# Altium project 6th design.PrjPcb
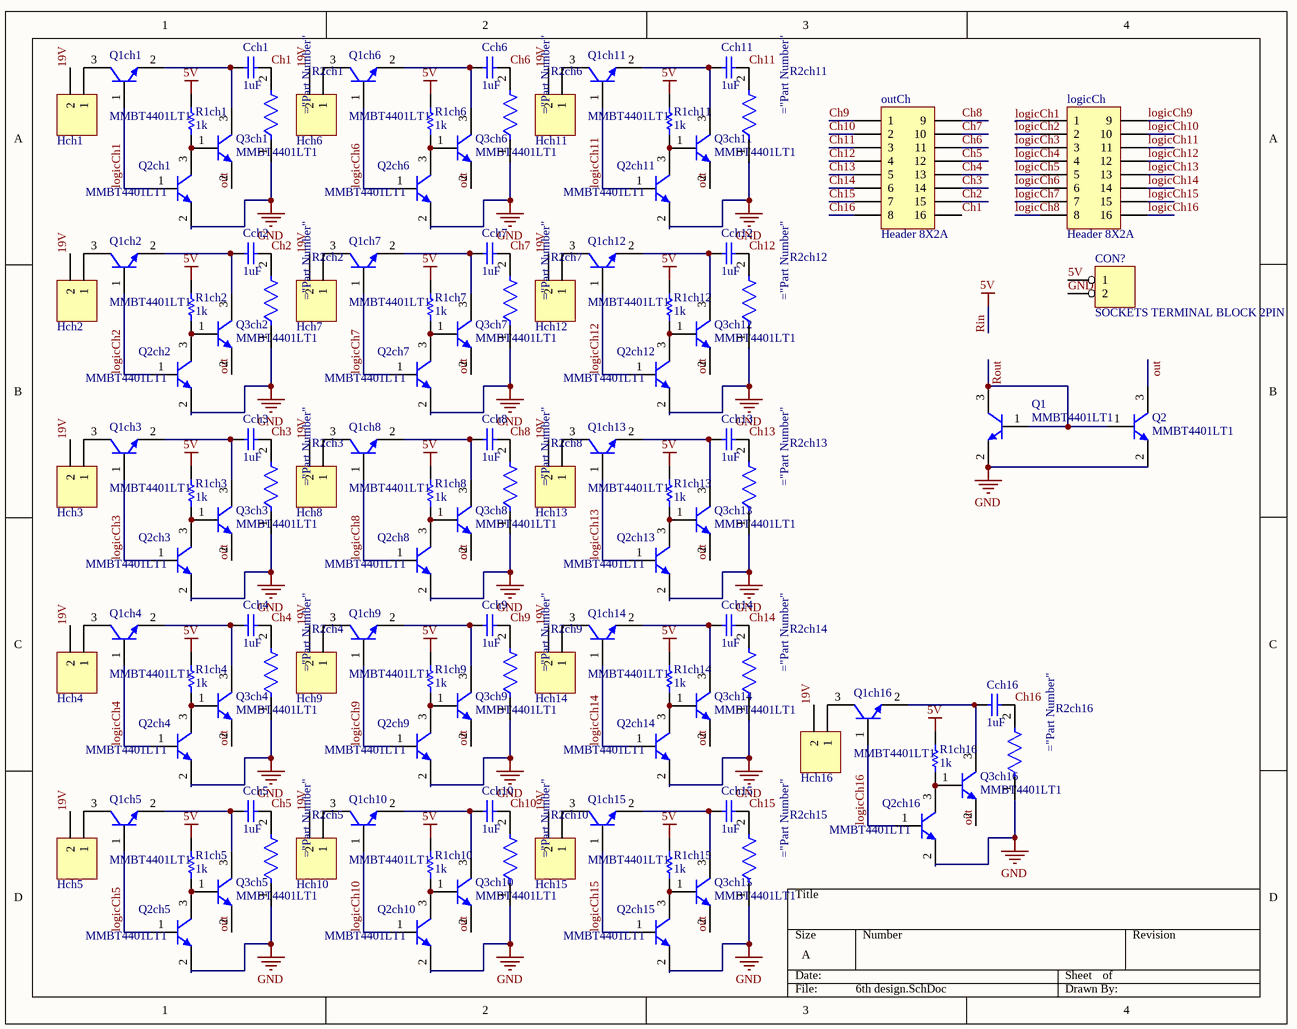
[diagram p0: 6th design.SchDoc]
3 sheets, 142 parts. Net scope: global (net labels, ports and power ports of the same name join across sheets).
Board file: 6th design.PcbDoc
Sheets:
  6th design.SchDoc
  digipot.SchDoc
  step-up.SchDoc

## Sheet 6th design.SchDoc
size A

### Parts
Cch1  value 1uF  [CC2012-0805]  (hidden comment: Cap-NP)
Cch2  value 1uF  [CC2012-0805]  (hidden comment: Cap-NP)
Cch3  value 1uF  [CC2012-0805]  (hidden comment: Cap-NP)
Cch4  value 1uF  [CC2012-0805]  (hidden comment: Cap-NP)
Cch5  value 1uF  [CC2012-0805]  (hidden comment: Cap-NP)
Cch6  value 1uF  [CC2012-0805]  (hidden comment: Cap-NP)
Cch7  value 1uF  [CC2012-0805]  (hidden comment: Cap-NP)
Cch8  value 1uF  [CC2012-0805]  (hidden comment: Cap-NP)
Cch9  value 1uF  [CC2012-0805]  (hidden comment: Cap-NP)
Cch10  value 1uF  [CC2012-0805]  (hidden comment: Cap-NP)
Cch11  value 1uF  [CC2012-0805]  (hidden comment: Cap-NP)
Cch12  value 1uF  [CC2012-0805]  (hidden comment: Cap-NP)
Cch13  value 1uF  [CC2012-0805]  (hidden comment: Cap-NP)
Cch14  value 1uF  [CC2012-0805]  (hidden comment: Cap-NP)
Cch15  value 1uF  [CC2012-0805]  (hidden comment: Cap-NP)
Cch16  value 1uF  [CC2012-0805]  (hidden comment: Cap-NP)
CON?  SOCKETS TERMINAL BLOCK 2PIN  [Sockets Terminal Block 2Pin]
Hch1  H2  [HDR1X2]  (value not drawn)
Hch2  H2  [HDR1X2]  (value not drawn)
Hch3  H2  [HDR1X2]  (value not drawn)
Hch4  H2  [HDR1X2]  (value not drawn)
Hch5  H2  [HDR1X2]  (value not drawn)
Hch6  H2  [HDR1X2]  (value not drawn)
Hch7  H2  [HDR1X2]  (value not drawn)
Hch8  H2  [HDR1X2]  (value not drawn)
Hch9  H2  [HDR1X2]  (value not drawn)
Hch10  H2  [HDR1X2]  (value not drawn)
Hch11  H2  [HDR1X2]  (value not drawn)
Hch12  H2  [HDR1X2]  (value not drawn)
Hch13  H2  [HDR1X2]  (value not drawn)
Hch14  H2  [HDR1X2]  (value not drawn)
Hch15  H2  [HDR1X2]  (value not drawn)
Hch16  H2  [HDR1X2]  (value not drawn)
logicCh  Header 8X2A  [HDR2X8_CEN]
outCh  Header 8X2A  [HDR2X8_CEN]
Q1  MMBT4401LT1  [ONSC-SOT-23-3-318-08_V]
Q1ch1  MMBT4401LT1  [ONSC-SOT-23-3-318-08_V]
Q1ch2  MMBT4401LT1  [ONSC-SOT-23-3-318-08_V]
Q1ch3  MMBT4401LT1  [ONSC-SOT-23-3-318-08_V]
Q1ch4  MMBT4401LT1  [ONSC-SOT-23-3-318-08_V]
Q1ch5  MMBT4401LT1  [ONSC-SOT-23-3-318-08_V]
Q1ch6  MMBT4401LT1  [ONSC-SOT-23-3-318-08_V]
Q1ch7  MMBT4401LT1  [ONSC-SOT-23-3-318-08_V]
Q1ch8  MMBT4401LT1  [ONSC-SOT-23-3-318-08_V]
Q1ch9  MMBT4401LT1  [ONSC-SOT-23-3-318-08_V]
Q1ch10  MMBT4401LT1  [ONSC-SOT-23-3-318-08_V]
Q1ch11  MMBT4401LT1  [ONSC-SOT-23-3-318-08_V]
Q1ch12  MMBT4401LT1  [ONSC-SOT-23-3-318-08_V]
Q1ch13  MMBT4401LT1  [ONSC-SOT-23-3-318-08_V]
Q1ch14  MMBT4401LT1  [ONSC-SOT-23-3-318-08_V]
Q1ch15  MMBT4401LT1  [ONSC-SOT-23-3-318-08_V]
Q1ch16  MMBT4401LT1  [ONSC-SOT-23-3-318-08_V]
Q2  MMBT4401LT1  [ONSC-SOT-23-3-318-08_V]
Q2ch1  MMBT4401LT1  [ONSC-SOT-23-3-318-08_V]
Q2ch2  MMBT4401LT1  [ONSC-SOT-23-3-318-08_V]
Q2ch3  MMBT4401LT1  [ONSC-SOT-23-3-318-08_V]
Q2ch4  MMBT4401LT1  [ONSC-SOT-23-3-318-08_V]
Q2ch5  MMBT4401LT1  [ONSC-SOT-23-3-318-08_V]
Q2ch6  MMBT4401LT1  [ONSC-SOT-23-3-318-08_V]
Q2ch7  MMBT4401LT1  [ONSC-SOT-23-3-318-08_V]
Q2ch8  MMBT4401LT1  [ONSC-SOT-23-3-318-08_V]
Q2ch9  MMBT4401LT1  [ONSC-SOT-23-3-318-08_V]
Q2ch10  MMBT4401LT1  [ONSC-SOT-23-3-318-08_V]
Q2ch11  MMBT4401LT1  [ONSC-SOT-23-3-318-08_V]
Q2ch12  MMBT4401LT1  [ONSC-SOT-23-3-318-08_V]
Q2ch13  MMBT4401LT1  [ONSC-SOT-23-3-318-08_V]
Q2ch14  MMBT4401LT1  [ONSC-SOT-23-3-318-08_V]
Q2ch15  MMBT4401LT1  [ONSC-SOT-23-3-318-08_V]
Q2ch16  MMBT4401LT1  [ONSC-SOT-23-3-318-08_V]
Q3ch1  MMBT4401LT1  [ONSC-SOT-23-3-318-08_V]
Q3ch2  MMBT4401LT1  [ONSC-SOT-23-3-318-08_V]
Q3ch3  MMBT4401LT1  [ONSC-SOT-23-3-318-08_V]
Q3ch4  MMBT4401LT1  [ONSC-SOT-23-3-318-08_V]
Q3ch5  MMBT4401LT1  [ONSC-SOT-23-3-318-08_V]
Q3ch6  MMBT4401LT1  [ONSC-SOT-23-3-318-08_V]
Q3ch7  MMBT4401LT1  [ONSC-SOT-23-3-318-08_V]
Q3ch8  MMBT4401LT1  [ONSC-SOT-23-3-318-08_V]
Q3ch9  MMBT4401LT1  [ONSC-SOT-23-3-318-08_V]
Q3ch10  MMBT4401LT1  [ONSC-SOT-23-3-318-08_V]
Q3ch11  MMBT4401LT1  [ONSC-SOT-23-3-318-08_V]
Q3ch12  MMBT4401LT1  [ONSC-SOT-23-3-318-08_V]
Q3ch13  MMBT4401LT1  [ONSC-SOT-23-3-318-08_V]
Q3ch14  MMBT4401LT1  [ONSC-SOT-23-3-318-08_V]
Q3ch15  MMBT4401LT1  [ONSC-SOT-23-3-318-08_V]
Q3ch16  MMBT4401LT1  [ONSC-SOT-23-3-318-08_V]
R1ch1  value 1k  [CC2012-0805]  (hidden comment: Res)
R1ch2  value 1k  [CC2012-0805]  (hidden comment: Res)
R1ch3  value 1k  [CC2012-0805]  (hidden comment: Res)
R1ch4  value 1k  [CC2012-0805]  (hidden comment: Res)
R1ch5  value 1k  [CC2012-0805]  (hidden comment: Res)
R1ch6  value 1k  [CC2012-0805]  (hidden comment: Res)
R1ch7  value 1k  [CC2012-0805]  (hidden comment: Res)
R1ch8  value 1k  [CC2012-0805]  (hidden comment: Res)
R1ch9  value 1k  [CC2012-0805]  (hidden comment: Res)
R1ch10  value 1k  [CC2012-0805]  (hidden comment: Res)
R1ch11  value 1k  [CC2012-0805]  (hidden comment: Res)
R1ch12  value 1k  [CC2012-0805]  (hidden comment: Res)
R1ch13  value 1k  [CC2012-0805]  (hidden comment: Res)
R1ch14  value 1k  [CC2012-0805]  (hidden comment: Res)
R1ch15  value 1k  [CC2012-0805]  (hidden comment: Res)
R1ch16  value 1k  [CC2012-0805]  (hidden comment: Res)
R2ch1  ERJ-A1BJ1R2U  [Panasonic_ERJ-A1BJ1R2U_0]  (value not drawn)
R2ch2  ERJ-A1BJ1R2U  [Panasonic_ERJ-A1BJ1R2U_0]  (value not drawn)
R2ch3  ERJ-A1BJ1R2U  [Panasonic_ERJ-A1BJ1R2U_0]  (value not drawn)
R2ch4  ERJ-A1BJ1R2U  [Panasonic_ERJ-A1BJ1R2U_0]  (value not drawn)
R2ch5  ERJ-A1BJ1R2U  [Panasonic_ERJ-A1BJ1R2U_0]  (value not drawn)
R2ch6  ERJ-A1BJ1R2U  [Panasonic_ERJ-A1BJ1R2U_0]  (value not drawn)
R2ch7  ERJ-A1BJ1R2U  [Panasonic_ERJ-A1BJ1R2U_0]  (value not drawn)
R2ch8  ERJ-A1BJ1R2U  [Panasonic_ERJ-A1BJ1R2U_0]  (value not drawn)
R2ch9  ERJ-A1BJ1R2U  [Panasonic_ERJ-A1BJ1R2U_0]  (value not drawn)
R2ch10  ERJ-A1BJ1R2U  [Panasonic_ERJ-A1BJ1R2U_0]  (value not drawn)
R2ch11  ERJ-A1BJ1R2U  [Panasonic_ERJ-A1BJ1R2U_0]  (value not drawn)
R2ch12  ERJ-A1BJ1R2U  [Panasonic_ERJ-A1BJ1R2U_0]  (value not drawn)
R2ch13  ERJ-A1BJ1R2U  [Panasonic_ERJ-A1BJ1R2U_0]  (value not drawn)
R2ch14  ERJ-A1BJ1R2U  [Panasonic_ERJ-A1BJ1R2U_0]  (value not drawn)
R2ch15  ERJ-A1BJ1R2U  [Panasonic_ERJ-A1BJ1R2U_0]  (value not drawn)
R2ch16  ERJ-A1BJ1R2U  [Panasonic_ERJ-A1BJ1R2U_0]  (value not drawn)

### Nets
5V: CON?.1 R1ch1.1 R1ch2.1 R1ch3.1 R1ch4.1 R1ch5.1 R1ch6.1 R1ch7.1 R1ch8.1 R1ch9.1 R1ch10.1 R1ch11.1 R1ch12.1 R1ch13.1 R1ch14.1 R1ch15.1 R1ch16.1  [also labelled Rin]
GND: CON?.2 Q1.2(E) Q2.2(E) Q2ch1.2(E) Q2ch2.2(E) Q2ch3.2(E) Q2ch4.2(E) Q2ch5.2(E) Q2ch6.2(E) Q2ch7.2(E) Q2ch8.2(E) Q2ch9.2(E) Q2ch10.2(E) Q2ch11.2(E) Q2ch12.2(E) Q2ch13.2(E) Q2ch14.2(E) Q2ch15.2(E) Q2ch16.2(E) R2ch1.1 R2ch2.1 R2ch3.1 R2ch4.1 R2ch5.1 R2ch6.1 R2ch7.1 R2ch8.1 R2ch9.1 R2ch10.1 R2ch11.1 R2ch12.1 R2ch13.1 R2ch14.1 R2ch15.1 R2ch16.1
19V: Hch1.2 Hch2.2 Hch3.2 Hch4.2 Hch5.2 Hch6.2 Hch7.2 Hch8.2 Hch9.2 Hch10.2 Hch11.2 Hch12.2 Hch13.2 Hch14.2 Hch15.2 Hch16.2
Ch1: Cch1.2 outCh.16 R2ch1.2
Ch2: Cch2.2 outCh.15 R2ch2.2
Ch3: Cch3.2 outCh.14 R2ch3.2
Ch4: Cch4.2 outCh.13 R2ch4.2
Ch5: Cch5.2 outCh.12 R2ch5.2
Ch6: Cch6.2 outCh.11 R2ch6.2
Ch7: Cch7.2 outCh.10 R2ch7.2
Ch8: Cch8.2 outCh.9 R2ch8.2
Ch9: Cch9.2 outCh.1 R2ch9.2
Ch10: Cch10.2 outCh.2 R2ch10.2
Ch11: Cch11.2 outCh.3 R2ch11.2
Ch12: Cch12.2 outCh.4 R2ch12.2
Ch13: Cch13.2 outCh.5 R2ch13.2
Ch14: Cch14.2 outCh.6 R2ch14.2
Ch15: Cch15.2 outCh.7 R2ch15.2
Ch16: Cch16.2 outCh.8 R2ch16.2
logicCh1: logicCh.1 Q1ch1.1(B) Q2ch1.1(B)
logicCh2: logicCh.2 Q1ch2.1(B) Q2ch2.1(B)
logicCh3: logicCh.3 Q1ch3.1(B) Q2ch3.1(B)
logicCh4: logicCh.4 Q1ch4.1(B) Q2ch4.1(B)
logicCh5: logicCh.5 Q1ch5.1(B) Q2ch5.1(B)
logicCh6: logicCh.6 Q1ch6.1(B) Q2ch6.1(B)
logicCh7: logicCh.7 Q1ch7.1(B) Q2ch7.1(B)
logicCh8: logicCh.8 Q1ch8.1(B) Q2ch8.1(B)
logicCh9: logicCh.9 Q1ch9.1(B) Q2ch9.1(B)
logicCh10: logicCh.10 Q1ch10.1(B) Q2ch10.1(B)
logicCh11: logicCh.11 Q1ch11.1(B) Q2ch11.1(B)
logicCh12: logicCh.12 Q1ch12.1(B) Q2ch12.1(B)
logicCh13: logicCh.13 Q1ch13.1(B) Q2ch13.1(B)
logicCh14: logicCh.14 Q1ch14.1(B) Q2ch14.1(B)
logicCh15: logicCh.15 Q1ch15.1(B) Q2ch15.1(B)
logicCh16: logicCh.16 Q1ch16.1(B) Q2ch16.1(B)
out: Q2.3(C) Q3ch1.2(E) Q3ch2.2(E) Q3ch3.2(E) Q3ch4.2(E) Q3ch5.2(E) Q3ch6.2(E) Q3ch7.2(E) Q3ch8.2(E) Q3ch9.2(E) Q3ch10.2(E) Q3ch11.2(E) Q3ch12.2(E) Q3ch13.2(E) Q3ch14.2(E) Q3ch15.2(E) Q3ch16.2(E)
Rout: Q1.1(B) Q1.3(C) Q2.1(B)
NetCch1_1: Cch1.1 Q1ch1.2(E) Q3ch1.3(C)
NetCch2_1: Cch2.1 Q1ch2.2(E) Q3ch2.3(C)
NetCch3_1: Cch3.1 Q1ch3.2(E) Q3ch3.3(C)
NetCch4_1: Cch4.1 Q1ch4.2(E) Q3ch4.3(C)
NetCch5_1: Cch5.1 Q1ch5.2(E) Q3ch5.3(C)
NetCch6_1: Cch6.1 Q1ch6.2(E) Q3ch6.3(C)
NetCch7_1: Cch7.1 Q1ch7.2(E) Q3ch7.3(C)
NetCch8_1: Cch8.1 Q1ch8.2(E) Q3ch8.3(C)
NetCch9_1: Cch9.1 Q1ch9.2(E) Q3ch9.3(C)
NetCch10_1: Cch10.1 Q1ch10.2(E) Q3ch10.3(C)
NetCch11_1: Cch11.1 Q1ch11.2(E) Q3ch11.3(C)
NetCch12_1: Cch12.1 Q1ch12.2(E) Q3ch12.3(C)
NetCch13_1: Cch13.1 Q1ch13.2(E) Q3ch13.3(C)
NetCch14_1: Cch14.1 Q1ch14.2(E) Q3ch14.3(C)
NetCch15_1: Cch15.1 Q1ch15.2(E) Q3ch15.3(C)
NetCch16_1: Cch16.1 Q1ch16.2(E) Q3ch16.3(C)
NetHch1_1: Hch1.1 Q1ch1.3(C)
NetHch2_1: Hch2.1 Q1ch2.3(C)
NetHch3_1: Hch3.1 Q1ch3.3(C)
NetHch4_1: Hch4.1 Q1ch4.3(C)
NetHch5_1: Hch5.1 Q1ch5.3(C)
NetHch6_1: Hch6.1 Q1ch6.3(C)
NetHch7_1: Hch7.1 Q1ch7.3(C)
NetHch8_1: Hch8.1 Q1ch8.3(C)
NetHch9_1: Hch9.1 Q1ch9.3(C)
NetHch10_1: Hch10.1 Q1ch10.3(C)
NetHch11_1: Hch11.1 Q1ch11.3(C)
NetHch12_1: Hch12.1 Q1ch12.3(C)
NetHch13_1: Hch13.1 Q1ch13.3(C)
NetHch14_1: Hch14.1 Q1ch14.3(C)
NetHch15_1: Hch15.1 Q1ch15.3(C)
NetHch16_1: Hch16.1 Q1ch16.3(C)
NetQ2ch1_3: Q2ch1.3(C) Q3ch1.1(B) R1ch1.2
NetQ2ch2_3: Q2ch2.3(C) Q3ch2.1(B) R1ch2.2
NetQ2ch3_3: Q2ch3.3(C) Q3ch3.1(B) R1ch3.2
NetQ2ch4_3: Q2ch4.3(C) Q3ch4.1(B) R1ch4.2
NetQ2ch5_3: Q2ch5.3(C) Q3ch5.1(B) R1ch5.2
NetQ2ch6_3: Q2ch6.3(C) Q3ch6.1(B) R1ch6.2
NetQ2ch7_3: Q2ch7.3(C) Q3ch7.1(B) R1ch7.2
NetQ2ch8_3: Q2ch8.3(C) Q3ch8.1(B) R1ch8.2
NetQ2ch9_3: Q2ch9.3(C) Q3ch9.1(B) R1ch9.2
NetQ2ch10_3: Q2ch10.3(C) Q3ch10.1(B) R1ch10.2
NetQ2ch11_3: Q2ch11.3(C) Q3ch11.1(B) R1ch11.2
NetQ2ch12_3: Q2ch12.3(C) Q3ch12.1(B) R1ch12.2
NetQ2ch13_3: Q2ch13.3(C) Q3ch13.1(B) R1ch13.2
NetQ2ch14_3: Q2ch14.3(C) Q3ch14.1(B) R1ch14.2
NetQ2ch15_3: Q2ch15.3(C) Q3ch15.1(B) R1ch15.2
NetQ2ch16_3: Q2ch16.3(C) Q3ch16.1(B) R1ch16.2

### Library data of the parts
Cch1-Cch16 = Cap-NP: Capacitor; Manufacturer: Generic Components; Class I: Passive; Published: 8-Jun-2000; Revision: July-2002: Re-released for DXP Platform.; Publisher: Altium Limited; Class II: Capacitor
Hch1-Hch16 = Header 2: Header, 2-Pin; LatestRevisionDate: 17-Jul-2002; LatestRevisionNote: Re-released for DXP Platform.; Publisher: Altium Limited
logicCh outCh = Header 8X2A: Header, 8-Pin, Dual row; LatestRevisionDate: 17-Jul-2002; LatestRevisionNote: Re-released for DXP Platform.; Publisher: Altium Limited
Q1 Q1ch1-Q1ch16 Q2 Q2ch1-Q2ch16 Q3ch1-Q3ch16 = MMBT4401LT1: Switching Transistor, NPN Silicon, 3-Pin SOT-23, Tape and Reel; Manufacturer: On Semiconductor; fT Min (MHz): 250; IC Continuous (A): 0.6; Polarity: NPN; ComponentLink1Description: Manufacturer URL; ComponentLink2Description: Datasheet; PartNumber: MMBT4401LT1; DatasheetVersion: Rev. 10; Mounting Technology: Surface Mount; ComponentLink3URL: http://www.onsemi.cn/pub_link/Collateral/318-08.PDF; ComponentLink3Description: Package Specification; ComponentLink1URL: http://www.onsemi.com/; Packing: Tape and Reel; PackageVersion: Rev. AP, 11/2009; PackageDescription: 3-Pin Small Outline Transistor, Body 2.92 x 1.3 mm, Pitch 0.95 mm; ComponentLink2URL: http://www.onsemi.cn/pub_link/Collateral/MMBT4401LT1-D.PDF; RoHS: FALSE; PackageReference: SOT-23-3-318-08
R1ch1-R1ch16 = Res: Resistor; Manufacturer: Generic Components; Class I: Passive; Published: 8-Jun-2000; Revision: July-2002: Re-released for DXP Platform.; Publisher: Altium Limited; Class II: Resistor

## Sheet digipot.SchDoc
size A
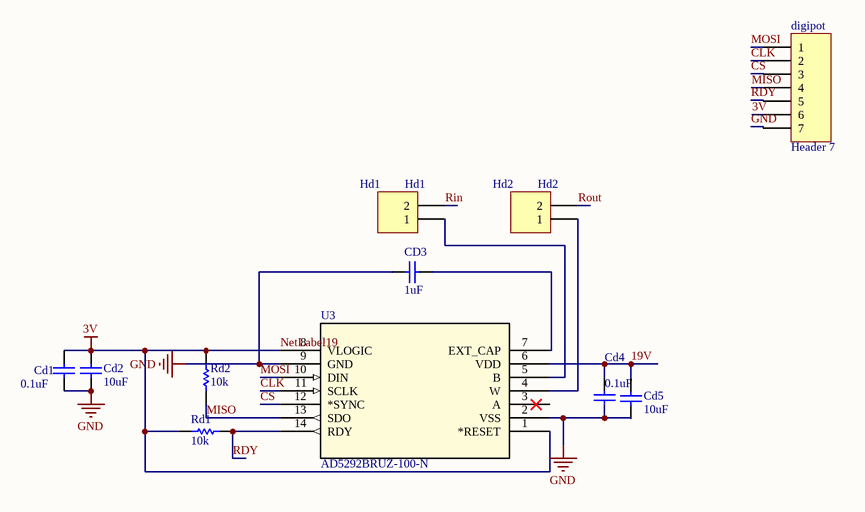
[diagram p1: digipot.SchDoc]

### Parts
Cd1  value 0.1uF  [CC2012-0805]  (hidden comment: Cap-NP)
Cd2  value 10uF  [CC2012-0805]  (hidden comment: Cap-NP)
CD3  value 1uF  [CC2012-0805]  (hidden comment: Cap-NP)
Cd4  value 0.1uF  [CC2012-0805]  (hidden comment: Cap-NP)
Cd5  value 10uF  [CC2012-0805]  (hidden comment: Cap-NP)
digipot  Header 7  [HDR1X7]
Hd1  Hd1  [HDR1X2]
Hd2  Hd2  [HDR1X2]
Rd1  value 10k  [CC2012-0805]  (hidden comment: Res)
Rd2  value 10k  [CC2012-0805]  (hidden comment: Res)
U3  AD5292BRUZ-100-N  [RU_14]

### Nets
3V: Cd1.1 Cd2.1 digipot.6 Rd1.2 Rd2.1 U3.1(*RESET) U3.8(VLOGIC)  [also labelled NetLabel19]
GND: Cd1.2 Cd2.2 CD3.1 Cd4.1 Cd5.1 digipot.7 U3.2(VSS) U3.9(GND)
Rin: Hd1.2  [project net 5V]
19V: Cd4.2 Cd5.2 U3.6(VDD)
CLK: digipot.2 U3.11(SCLK)
CS: digipot.3 U3.12(*SYNC)
MISO: digipot.4 Rd2.2 U3.13(SDO)
MOSI: digipot.1 U3.10(DIN)
RDY: digipot.5 Rd1.1 U3.14(RDY)
Rout: Hd2.2
NetCD3_2: CD3.2 U3.7(EXT_CAP)
NetHd1_1: Hd1.1 U3.5(B)
NetHd2_1: Hd2.1 U3.4(W)

Not connected (* = marked no-connect by the designer): U3 3(A)

### Library data of the parts
Cd1 Cd2 CD3 Cd4 Cd5 = Cap-NP: as Cch1 on sheet 6th design; Published: 8-Jun-2000; Revision: July-2002: Re-released for DXP Platform.; Publisher: Altium Limited; Class II: Capacitor
digipot = Header 7: Header, 7-Pin; LatestRevisionDate: 17-Jul-2002; LatestRevisionNote: Re-released for DXP Platform.; Publisher: Altium Limited
Hd1 Hd2 = Header 2: Header, 2-Pin; LatestRevisionDate: 17-Jul-2002; LatestRevisionNote: Re-released for DXP Platform.; Publisher: Altium Limited
Rd1 Rd2 = Res: as R1ch1 on sheet 6th design; Published: 8-Jun-2000; Revision: July-2002: Re-released for DXP Platform.; Publisher: Altium Limited; Class II: Resistor
U3 = AD5292BRUZ-100-N: Imported; Manufacturer_Part_Number: AD5292BRUZ-100-ND; Vendor: Analog Devices Inc; Built_By: EMA_UL_Team; RefDes: RefDes; Type: DEV; Value: Value

## Sheet step-up.SchDoc
size A
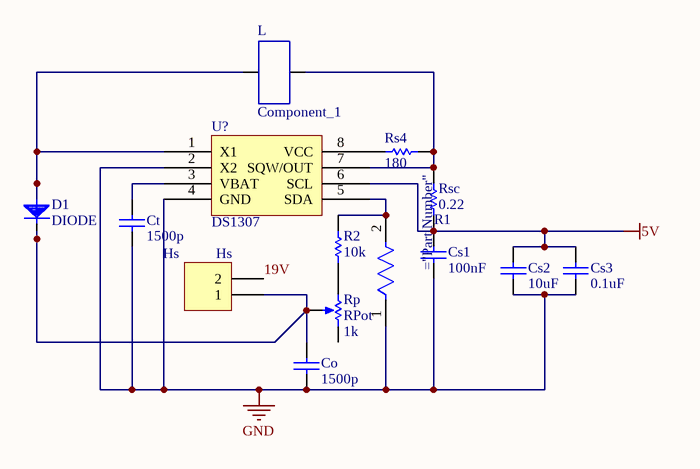
[diagram p2: step-up.SchDoc]

### Parts
Co  value 1500p  [CC2012-0805]  (hidden comment: Cap-NP)
Cs1  value 100nF  [CC2012-0805]  (hidden comment: Cap-NP)
Cs2  value 10uF  [CC2012-0805]  (hidden comment: Cap-NP)
Cs3  value 0.1uF  [CC2012-0805]  (hidden comment: Cap-NP)
Ct  value 1500p  [CC2012-0805]  (hidden comment: Cap-NP)
D1  DIODE  [D1N40XX]
Hs  Hs  [HDR1X2]
L  Component_1  [PCBComponent_1]
R1  ERJ-A1BJ1R2U  [Panasonic_ERJ-A1BJ1R2U_0]  (value not drawn)
R2  value 10k  [R5W]  (hidden comment: Res)
Rp  RPot  value 1k  [VR_MUL-V]
Rs4  value 180  [CC2012-0805]  (hidden comment: Res)
Rsc  value 0.22  [CC2012-0805]  (hidden comment: Res)
U?  DS1307  [DIP8L]

### Nets
5V: Cs1.2 Cs2.1 Cs3.1 Rsc.1 U?.6(SCL)
GND: Co.1 Cs1.1 Cs2.2 Cs3.2 Ct.1 R1.1 U?.2(X2) U?.4(GND)
19V: Hs.2
NetCo_2: Co.2 D1.1(K) Hs.1 Rp.2(TAP)
NetCt_2: Ct.2 U?.3(VBAT)
NetD1_2: D1.2(a) L.1 U?.1(X1)
NetL_2: L.2 Rs4.2 Rsc.2 U?.7(SQW/OUT)
NetR1_2: R1.2 R2.2 U?.5(SDA)
NetR2_1: R2.1 Rp.1(TOP)
NetRs4_1: Rs4.1 U?.8(VCC)

Not connected (* = marked no-connect by the designer): Rp 3(BOT)

### Library data of the parts
Co Cs1-Cs3 Ct = Cap-NP: as Cch1 on sheet 6th design; Published: 8-Jun-2000; Revision: July-2002: Re-released for DXP Platform.; Publisher: Altium Limited; Class II: Capacitor
Hs = Header 2: Header, 2-Pin; LatestRevisionDate: 17-Jul-2002; LatestRevisionNote: Re-released for DXP Platform.; Publisher: Altium Limited
L = Component_1: power inductor
R2 Rs4 Rsc = Res: as R1ch1 on sheet 6th design; Published: 8-Jun-2000; Revision: July-2002: Re-released for DXP Platform.; Publisher: Altium Limited; Class II: Resistor
Rp = RPot: Potentiometer; Manufacturer: Generic Components; Class I: Passive; Set Position: 0.5; Published: 8-Jun-2000; Revision: July-2002: Re-released for DXP Platform.; Publisher: Altium Limited; Class II: Potentiometer

## Nets that join several sheets
5V: 6th design (17 pins), digipot (Hd1.2), step-up (5 pins)
GND: 6th design (35 pins), digipot (8 pins), step-up (8 pins)
19V: 6th design (16 pins), digipot (Cd4.2 Cd5.2 U3.6), step-up (Hs.2)
Rout: 6th design (Q1.1 Q1.3 Q2.1), digipot (Hd2.2)